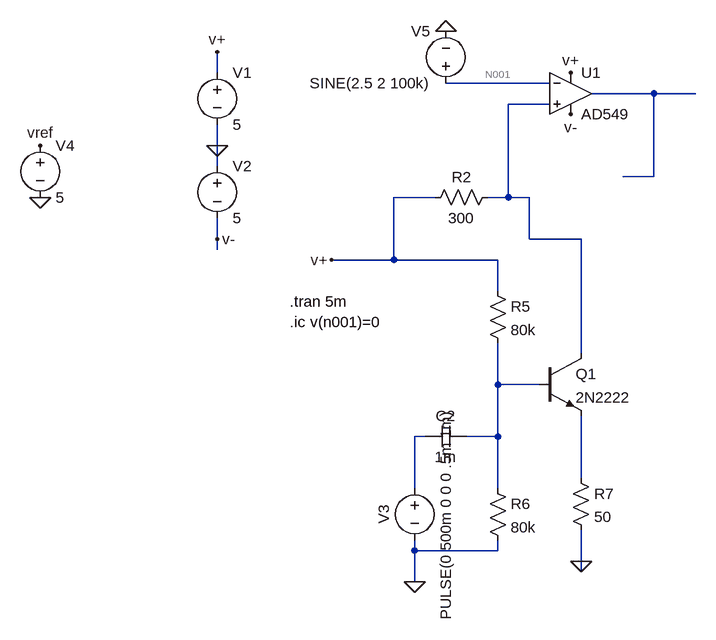
[diagram p0: schematic vco.asc]
vco.asc, the LTspice schematic file:
Version 4
SHEET 1 944 976
WIRE -272 112 -272 80
WIRE 240 128 80 128
WIRE 400 144 304 144
WIRE 464 144 400 144
WIRE 240 160 176 160
WIRE -272 224 -272 192
WIRE -272 256 -272 224
WIRE 400 272 400 144
WIRE 400 272 352 272
WIRE 64 304 0 304
WIRE 176 304 176 160
WIRE 176 304 144 304
WIRE 208 304 176 304
WIRE -272 368 -272 336
WIRE 208 368 208 304
WIRE 288 368 208 368
WIRE -272 384 -272 368
WIRE 0 400 0 304
WIRE 0 400 -96 400
WIRE 160 400 0 400
WIRE 160 448 160 400
WIRE 288 544 288 368
WIRE 160 592 160 528
WIRE 224 592 160 592
WIRE 48 672 32 672
WIRE 160 672 160 592
WIRE 160 672 112 672
WIRE 288 736 288 640
WIRE 32 752 32 672
WIRE 160 752 160 672
WIRE 32 848 32 832
WIRE 160 848 160 832
WIRE 160 848 32 848
WIRE 288 864 288 816
WIRE 288 880 288 864
WIRE 32 896 32 848
FLAG -272 224 0
FLAG -272 80 v+
FLAG 272 112 v+
FLAG -272 368 v-
FLAG 272 176 v-
FLAG 32 896 0
FLAG 288 864 0
FLAG -96 400 v+
FLAG -544 304 0
FLAG -544 224 vref
FLAG 80 48 0
SYMBOL res 160 288 R90
WINDOW 0 0 56 VBottom 2
WINDOW 3 32 56 VTop 2
SYMATTR InstName R2
SYMATTR Value 300
SYMBOL voltage -272 96 R0
WINDOW 123 0 0 Left 0
WINDOW 39 0 0 Left 0
SYMATTR InstName V1
SYMATTR Value 5
SYMBOL voltage -272 240 R0
WINDOW 123 0 0 Left 0
WINDOW 39 0 0 Left 0
SYMATTR InstName V2
SYMATTR Value 5
SYMBOL voltage 32 736 R0
WINDOW 0 -32 56 VBottom 2
WINDOW 3 32 56 VTop 2
WINDOW 123 0 0 Left 0
WINDOW 39 0 0 Left 0
SYMATTR InstName V3
SYMATTR Value PULSE(0 500m 0 0 0 .5m 1m)
SYMBOL res 144 432 R0
SYMATTR InstName R5
SYMATTR Value 80k
SYMBOL res 144 736 R0
SYMATTR InstName R6
SYMATTR Value 80k
SYMBOL cap 48 688 R270
WINDOW 0 32 32 VTop 2
WINDOW 3 0 32 VBottom 2
SYMATTR InstName C2
SYMATTR Value 1m
SYMBOL npn 224 544 R0
SYMATTR InstName Q1
SYMATTR Value 2N2222
SYMBOL voltage -544 208 R0
WINDOW 123 0 0 Left 0
WINDOW 39 0 0 Left 0
SYMATTR InstName V4
SYMATTR Value 5
SYMBOL res 272 720 R0
SYMATTR InstName R7
SYMATTR Value 50
SYMBOL OpAmps\\AD549 272 80 R0
SYMATTR InstName U1
SYMBOL voltage 80 144 R180
WINDOW 0 24 96 Left 2
WINDOW 3 24 16 Left 2
WINDOW 123 0 0 Left 0
WINDOW 39 0 0 Left 0
SYMATTR InstName V5
SYMATTR Value SINE(2.5 2 100k)
TEXT -160 496 Left 2 !.ic v(n001)=0
TEXT -160 464 Left 2 !.tran 5m

The netlist it stands for:
* vco.asc
R2 N003 v+ 300
V1 v+ 0 5
V2 0 v- 5
V3 N005 0 PULSE(0 500m 0 0 0 .5m 1m)
R5 v+ N004 80k
R6 N004 0 80k
C2 N005 N004 1m
Q1 N003 N004 N006 0 2N2222
V4 vref 0 5
R7 N006 0 50
XU1 N003 N001 v+ v- N002 AD549  ; pins In+ In- V+ V- OUT
V5 N001 0 SINE(2.5 2 100k)
.model NPN NPN
.model PNP PNP
.lib standard.bjt
.ic v(n001)=0
.tran 5m
.backanno
.end